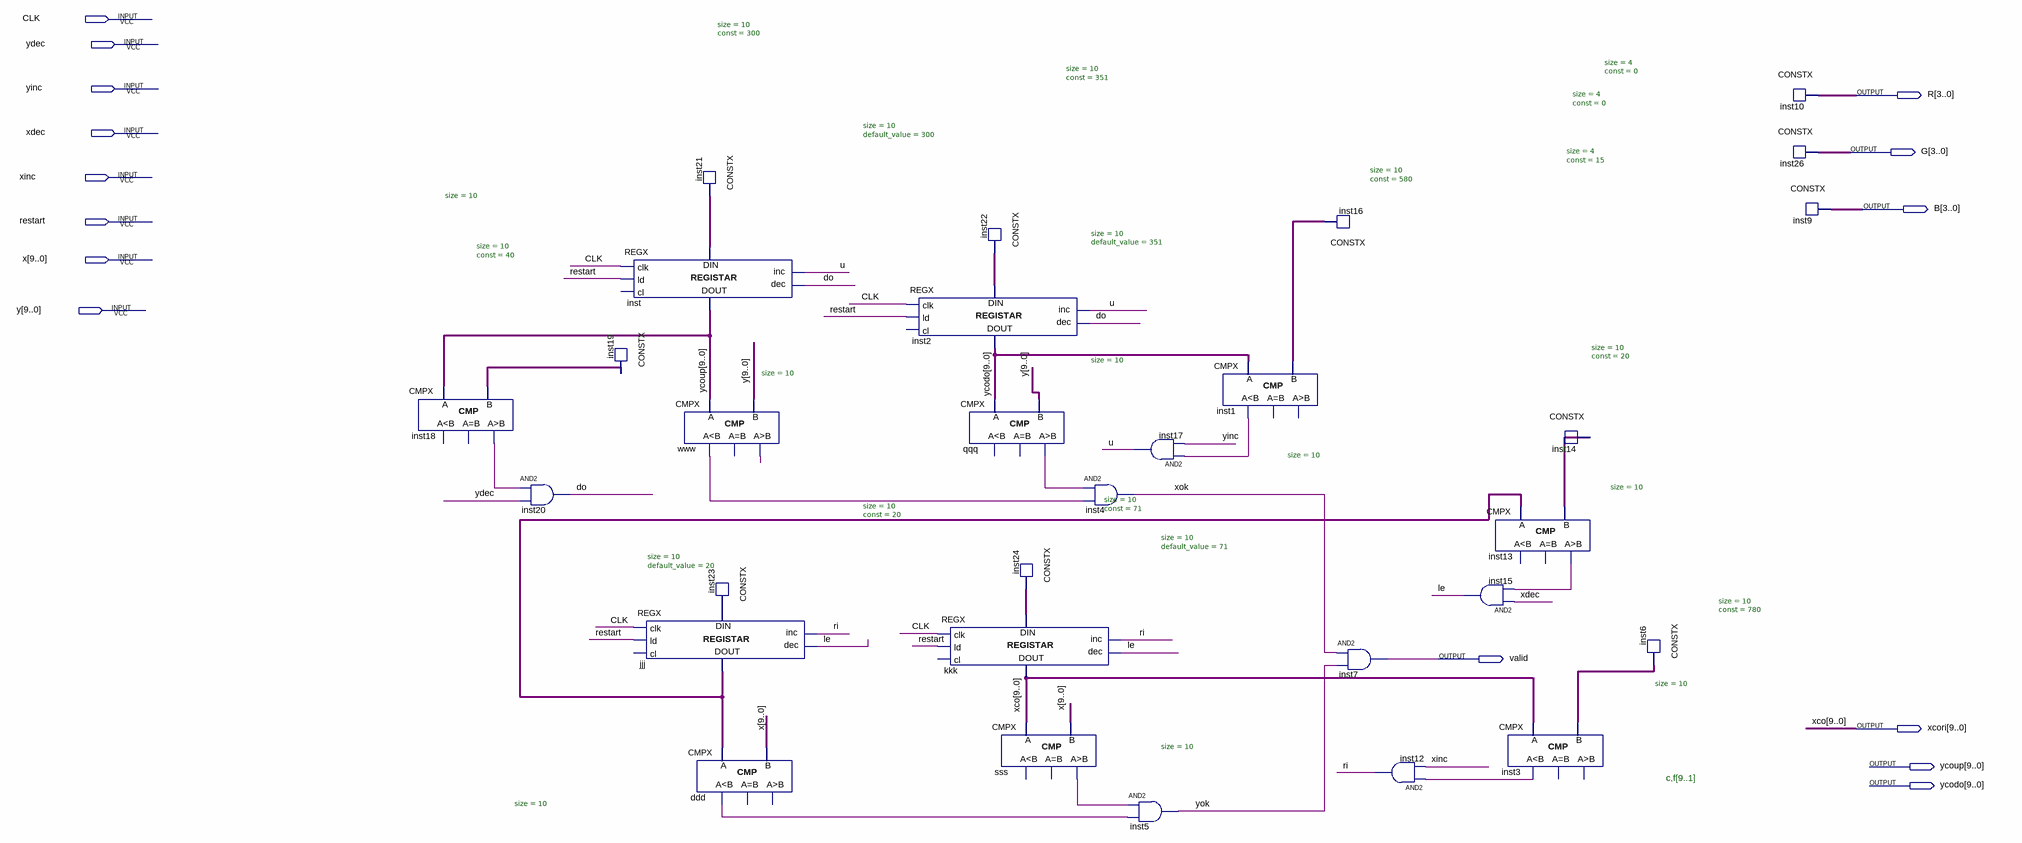
[diagram p0: schematic sheet]
// Quartus schematic player.bdf as structural Verilog: 30 symbols, 15 pins
module player (
  input  CLK,
  input  ydec,
  input  yinc,
  input  xdec,
  input  xinc,
  input  restart,
  input  [9:0] x,
  input  [9:0] y,
  output [3:0] R,
  output [3:0] G,
  output [3:0] B,
  output valid,
  output [9:0] xcori,
  output [9:0] ycoup,
  output [9:0] ycodo
);

  wire ddd_ls, \do , inst1_ls, inst3_ls, inst13_gr, inst18_gr, le, qqq_gr, ri, sss_gr, u, www_gr, www_ls,
       xok, yok;
  wire [9:0] inst6_data, inst14_data, inst16_data, inst19_data, inst21_data, inst22_data, inst23_data,
       inst24_data, jjj_data_out;

  CMPX #(.size(10)) inst18 (.A(ycoup), .B(inst19_data), .gr(inst18_gr));  // open: ls, eq
  and inst20 (\do , inst18_gr, ydec);
  REGX #(.size(10), .default_value(300)) inst (
    .clk(CLK), .ld(restart), .inc(u), .dec(\do ), .data_in(inst21_data), .data_out(ycoup));  // open: cl
  CONSTX #(.size(10), .\const (40)) inst19 (.data(inst19_data));
  REGX #(.size(10), .default_value(20)) jjj (
    .clk(CLK), .ld(restart), .inc(ri), .dec(le), .data_in(inst23_data), .data_out(jjj_data_out));  // open: cl
  CMPX #(.size(10)) www (.A(ycoup), .B(y), .ls(www_ls), .gr(www_gr));  // open: eq
  CMPX #(.size(10)) ddd (.A(jjj_data_out), .B(x), .ls(ddd_ls));  // open: eq, gr
  CONSTX #(.size(10), .\const (300)) inst21 (.data(inst21_data));
  CONSTX #(.size(10), .\const (20)) inst23 (.data(inst23_data));
  REGX #(.size(10), .default_value(351)) inst2 (
    .clk(CLK), .ld(restart), .inc(u), .dec(\do ), .data_in(inst22_data), .data_out(ycodo));  // open: cl
  REGX #(.size(10), .default_value(71)) kkk (
    .clk(CLK), .ld(restart), .inc(ri), .dec(le), .data_in(inst24_data), .data_out(xcori));  // open: cl
  CONSTX #(.size(10), .\const (351)) inst22 (.data(inst22_data));
  CMPX #(.size(10)) qqq (.A(ycodo), .B(y), .gr(qqq_gr));  // open: ls, eq
  CMPX #(.size(10)) sss (.A(xcori), .B(x), .gr(sss_gr));  // open: ls, eq
  CONSTX #(.size(10), .\const (71)) inst24 (.data(inst24_data));
  and inst4 (xok, qqq_gr, www_ls);
  and inst17 (u, inst1_ls, yinc);
  and inst5 (yok, sss_gr, ddd_ls);
  CMPX #(.size(10)) inst1 (.A(ycodo), .B(inst16_data), .ls(inst1_ls));  // open: eq, gr
  CONSTX #(.size(10), .\const (580)) inst16 (.data(inst16_data));
  and inst7 (valid, xok, yok);
  and inst12 (ri, inst3_ls, xinc);
  CMPX #(.size(10)) inst13 (.A(jjj_data_out), .B(inst14_data), .gr(inst13_gr));  // open: ls, eq
  and inst15 (le, xdec, inst13_gr);
  CMPX #(.size(10)) inst3 (.A(xcori), .B(inst6_data), .ls(inst3_ls));  // open: eq, gr
  CONSTX #(.size(10), .\const (20)) inst14 (.data(inst14_data));
  CONSTX #(.size(10), .\const (780)) inst6 (.data(inst6_data));
  CONSTX #(.size(4), .\const (0)) inst10 (.data(R));
  CONSTX #(.size(4), .\const (0)) inst26 (.data(G));
  CONSTX #(.size(4), .\const (15)) inst9 (.data(B));

  // Other names for the same wires on the sheet: xco[9:0] = xcori

  // Notes on the sheet:
  //   c,f[9..1]
endmodule
